# Altium schematic sheet RPi Motor Driver Rev 0.2.SchDoc
size C; GateName_1: G$1; SymbolName_1: FRAME_A3_ADAFRUIT; LibraryName: microbuilder; DeviceSetName: FRAME_A3_ADAFRUIT; Organization: Altium Limited; Address1: L3, 12a Rodborough Rd; Address2: Frenchs Forest; Address3: NSW; Address4: Australia 2086
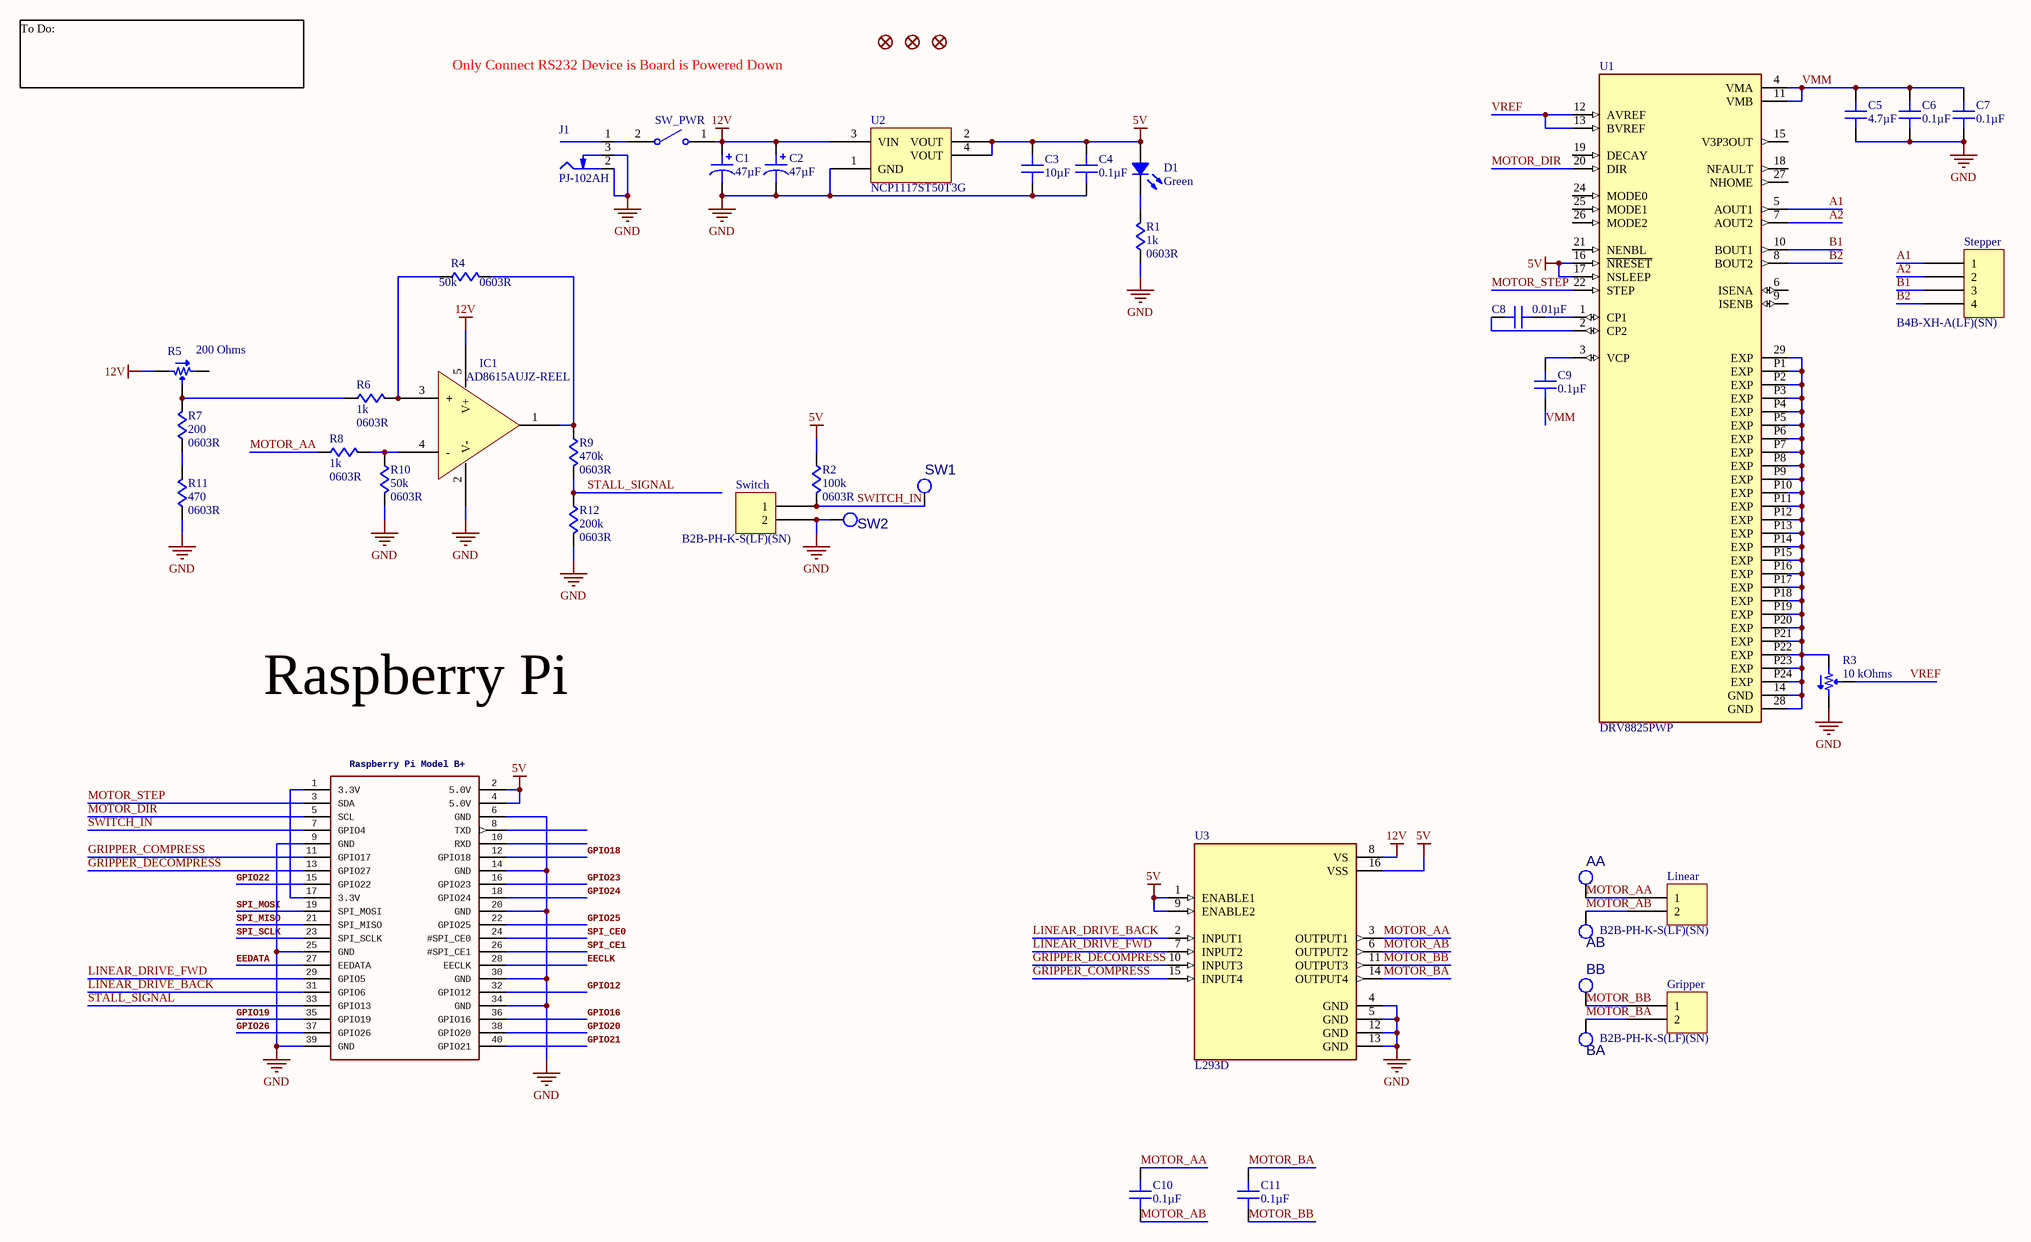
[diagram p0: RPi Motor Driver Rev 0.2.SchDoc]

## Parts
AA  TH_Testpoint_40mil  [TH_Testpoint_40mil]  (value not drawn)
AB  TH_Testpoint_40mil  [TH_Testpoint_40mil]  (value not drawn)
BA  TH_Testpoint_40mil  [TH_Testpoint_40mil]  (value not drawn)
BB  TH_Testpoint_40mil  [TH_Testpoint_40mil]  (value not drawn)
C1  47µF  [CAP ALSMD 6.6MM H6.1MM]
C2  47µF  [CAP ALSMD 6.6MM H6.1MM]
C3  10µF  [CAP 0805_2012]
C4  0.1µF  [CAP 0603_1608]
C5  4.7µF  [CAP 0603_1608]
C6  0.1µF  [CAP 0603_1608]
C7  0.1µF  [CAP 0603_1608]
C8  0.01µF  [CAP 0603_1608]
C9  0.1µF  [CAP 0603_1608]
C10  0.1µF  [CAP 0603_1608]
C11  0.1µF  [CAP 0603_1608]
D1  Green  [LED 0603_1608 GREEN]
FID1  FIDUCIAL""  [FIDUCIAL_1MM]  (value not drawn)
FID2  FIDUCIAL""  [FIDUCIAL_1MM]  (value not drawn)
FID3  FIDUCIAL""  [FIDUCIAL_1MM]  (value not drawn)
Gripper  B2B-PH-K-S(LF)(SN)  [JST B2B-PH-K]
IC1  AD8615AUJZ-REEL  [ANALOG TSOT-23-5 UJ-5]
J1  PJ-102AH  [CUI PJ-102AH]
Linear  B2B-PH-K-S(LF)(SN)  [JST B2B-PH-K]
R1  value 1k  [0603R]  (hidden comment: Resistor 0603)
R2  value 100k  [0603R]  (hidden comment: Resistor 0603)
R3  10 kOhms  [POT BOURNS TRIMPOT TC33]
R4  value 50k  [0603R]  (hidden comment: Resistor 0603)
R5  200 Ohms  [POT BOURNS TRIMPOT TC33]
R6  value 1k  [0603R]  (hidden comment: Resistor 0603)
R7  value 200  [0603R]  (hidden comment: Resistor 0603)
R8  value 1k  [0603R]  (hidden comment: Resistor 0603)
R9  value 470k  [0603R]  (hidden comment: Resistor 0603)
R10  value 50k  [0603R]  (hidden comment: Resistor 0603)
R11  value 470  [0603R]  (hidden comment: Resistor 0603)
R12  value 200k  [0603R]  (hidden comment: Resistor 0603)
RPI1  RaspberryPiModelB+: Raspberry Pi Model B+  [PI_HAT_SLOTS]  (hidden comment: RASPBERRYPI_BPLUS_HATSLOTS)
Stepper  B4B-XH-A(LF)(SN)  [JST XH B4B-XH-A]
SW1  TH_Testpoint_40mil  [TH_Testpoint_40mil]  (value not drawn)
SW2  TH_Testpoint_40mil  [TH_Testpoint_40mil]  (value not drawn)
SW_PWR  500SSP1S2M2QEA  [SWITCH SLIDE SPDT 5A 125V]  (value not drawn)
Switch  B2B-PH-K-S(LF)(SN)  [JST B2B-PH-K]
U1  DRV8825PWP  [SOP65P640X120-29N]
U2  NCP1117ST50T3G  [ON SEMI SOT-223 ST(318H)]
U3  L293D  [DIP880W50P254L2000H510Q16]

## Nets
5V: C3.2 C4.2 D1.1 R2.2 RPI1.2(5.0V) RPI1.4(5.0V) U1.16(~{NRESET}) U1.17(NSLEEP) U2.2(VOUT) U2.4(VOUT) U3.1(ENABLE1) U3.9(ENABLE2) U3.16(VSS)
12V: C1.1 C2.1 IC1.5(V+) R5.1 SW_PWR.1 U2.3(VIN) U3.8(VS)
GND: C1.2 C2.2 C3.1 C4.1 C5.1 C6.1 C7.1 IC1.2(V-) J1.2(Outer) J1.3(SW) R1.2 R3.3 R10.1 R11.2 R12.1 RPI1.6(GND) RPI1.9(GND) RPI1.14(GND) RPI1.20(GND) RPI1.25(GND) RPI1.30(GND) RPI1.34(GND) RPI1.39(GND) SW2.1 Switch.2 U2.1(GND) U3.4(GND) U3.5(GND) U3.12(GND) U3.13(GND)
A1: Stepper.1 U1.5(AOUT1)
A2: Stepper.2 U1.7(AOUT2)
B1: Stepper.3 U1.10(BOUT1)
B2: Stepper.4 U1.8(BOUT2)
EECLK: RPI1.28(EECLK)
EEDATA: RPI1.27(EEDATA)
GPIO12: RPI1.32(GPIO12)
GPIO16: RPI1.36(GPIO16)
GPIO18: RPI1.12(GPIO18)
GPIO19: RPI1.35(GPIO19)
GPIO20: RPI1.38(GPIO20)
GPIO21: RPI1.40(GPIO21)
GPIO22: RPI1.15(GPIO22)
GPIO23: RPI1.16(GPIO23)
GPIO24: RPI1.18(GPIO24)
GPIO25: RPI1.22(GPIO25)
GPIO26: RPI1.37(GPIO26)
GRIPPER_COMPRESS: RPI1.11(GPIO17) U3.15(INPUT4)
GRIPPER_DECOMPRESS: RPI1.13(GPIO27) U3.10(INPUT3)
LINEAR_DRIVE_BACK: RPI1.31(GPIO6) U3.2(INPUT1)
LINEAR_DRIVE_FWD: RPI1.29(GPIO5) U3.7(INPUT2)
MOTOR_AA: AA.1 C10.2 Linear.1 R8.2 U3.3(OUTPUT1)
MOTOR_AB: AB.1 C10.1 Linear.2 U3.6(OUTPUT2)
MOTOR_BA: BA.1 C11.2 Gripper.2 U3.14(OUTPUT4)
MOTOR_BB: BB.1 C11.1 Gripper.1 U3.11(OUTPUT3)
MOTOR_DIR: RPI1.5(SCL) U1.20(DIR)
MOTOR_STEP: RPI1.3(SDA) U1.22(STEP)
SPI_CE0: RPI1.24(#SPI_CE0)
SPI_CE1: RPI1.26(#SPI_CE1)
SPI_MISO: RPI1.21(SPI_MISO)
SPI_MOSI: RPI1.19(SPI_MOSI)
SPI_SCLK: RPI1.23(SPI_SCLK)
STALL_SIGNAL: R9.1 R12.2 RPI1.33(GPIO13)
SWITCH_IN: R2.1 RPI1.7(GPIO4) SW1.1 Switch.1
VMM: C5.2 C6.2 C7.2 C9.1 U1.4(VMA) U1.11(VMB)
VREF: R3.2 U1.12(AVREF) U1.13(BVREF)
NetC8_1: C8.1 U1.2(CP2)
NetC8_2: C8.2 U1.1(CP1)
NetC9_2: C9.2 U1.3(VCP)
NetD1_2: D1.2 R1.1
NetIC1_1: IC1.1(OUT) R4.1 R9.2
NetIC1_3: IC1.3(+) R4.2 R6.1
NetIC1_4: IC1.4(-) R8.1 R10.2
NetJ1_1: J1.1(Centre) SW_PWR.2
NetR3_1: R3.1 U1.14(GND) U1.28(GND) U1.29(EXP) U1.P1(EXP) U1.P2(EXP) U1.P3(EXP) U1.P4(EXP) U1.P5(EXP) U1.P6(EXP) U1.P7(EXP) U1.P8(EXP) U1.P9(EXP) U1.P10(EXP) U1.P11(EXP) U1.P12(EXP) U1.P13(EXP) U1.P14(EXP) U1.P15(EXP) U1.P16(EXP) U1.P17(EXP) U1.P18(EXP) U1.P19(EXP) U1.P20(EXP) U1.P21(EXP) U1.P22(EXP) U1.P23(EXP) U1.P24(EXP)
NetR5_2: R5.2 R6.2 R7.1
NetR7_2: R7.2 R11.1
NetRPI1_1: RPI1.1(3.3V) RPI1.17(3.3V)

Not connected (* = marked no-connect by the designer): R5 3; RPI1 8(TXD) 10(RXD); U1 6(ISENA) 9(ISENB) 15(V3P3OUT) 18(NFAULT) 19(DECAY) 21(NENBL) 24(MODE0) 25(MODE1) 26(MODE2) 27(NHOME)

## Notes on the sheet
- Only Connect RS232 Device is Board is Powered Down
- To Do:
- Raspberry Pi
- Title
- Size:
- Date:
- File:
- C
- Number:
- Time:
- Revision:
- Sheet
- of

## Library data of the parts
AA AB BA BB SW1 SW2 = TH_Testpoint_40mil: TH Testpoint
C1 C2 = UCD1V470MCL1GS: CAP ALUM 47UF 20% 35V SMD; Part Number: EEE-FP1V470AP; Manufacturer: Nichicon; Impedance: 360 mOhms; Lifetime @ Temp.: 2000 Hrs @ 105°C; Polarization: Polar; Ripple Current @ High Frequency: 240mA @ 100kHz; Ripple Current @ Low Frequency: 120mA @ 120Hz; Surface Mount Land Size: 0.260" L x 0.260" W (6.60mm x 6.60mm); Applications: Automotive; Capacitance: 47µF; ComponentLink1Description: Datasheet; ComponentLink1URL: http://nichicon-us.com/english/products/pdfs/e-ucd.pdf; ComponentLink2Description: DigiKey Link; ComponentLink2URL: http://digikey.com/product-detail/en/nichicon/UCD1V470MCL1GS/493-6426-1-ND/3438940; Device Package: Radial, Can - SMD; Height - Seated (Max): 0.240" (6.10mm); LastUpdated: 1/21/2020 4:04:57 AM; Lifecycle Status: Active; Minimum Order: 1; Mounting Type: Surface Mount; Operating Temperature: -55°C ~ 105°C; Package / Case: Radial, Can - SMD; Packaging: TapeAndReel; PartId: 8038; Part Status: Active; Price: 0.13; Ratings: AEC-Q200; Series: UCD; Size / Dimension: 0.248" Dia (6.30mm); Supplier 1: DigiKey; Supplier Part Number 1: 493-6426-1-ND; Tolerance: ±20%; Value: 47µF; Voltage - Rated: 35V
C3 = C2012X5R1E106K085AC: CAP CER 10UF 25V X5R 0805; Manufacturer: TDK Corporation; Tolerance: ±10%; Part Number: C2012X5R1E106K085AC; Value: 10µF; Applications: General Purpose; Capacitance: 10µF; ComponentLink1Description: Datasheet; ComponentLink1URL: https://product.tdk.com/info/en/catalog/datasheets/mlcc_commercial_general_en.pdf?ref_disty=digikey; ComponentLink2Description: DigiKey Link; ComponentLink2URL: http://digikey.com/product-detail/en/tdk-corporation/C2012X5R1E106K085AC/445-14387-1-ND/3956053; Device Package: 0805 (2012 Metric); Features: Low ESL; LastUpdated: 1/21/2020 12:02:45 AM; Lifecycle Status: Active; Minimum Order: 1; Mounting Type: Surface Mount, MLCC; Operating Temperature: -55°C ~ 85°C; Package / Case: 0805 (2012 Metric); Packaging: TapeAndReel; PartId: 15274; Part Status: Active; Price: 0.15; Series: C; Size / Dimension: 0.079" L x 0.049" W (2.00mm x 1.25mm); Supplier 1: DigiKey; Supplier Part Number 1: 445-14387-1-ND; Temperature Coefficient: X5R; Thickness (Max): 0.039" (1.00mm); Voltage - Rated: 25V
C4 C6 C7 C9-C11 = CGA3E2X7R1H104K080AE: CAP CER 0.1UF 50V X7R 0603; Manufacturer: TDK Corporation; Tolerance: ±10%; Part Number: CGA3E2X7R1H104K080AE; Value: 0.1µF; Applications: Automotive, Boardflex Sensitive; Capacitance: 0.1µF; ComponentLink1Description: Datasheet; ComponentLink1URL: https://product.tdk.com/info/en/catalog/datasheets/mlcc_automotive_soft_en.pdf?ref_disty=digikey; ComponentLink2Description: DigiKey Link; ComponentLink2URL: http://digikey.com/product-detail/en/tdk-corporation/CGA3E2X7R1H104K080AE/445-15957-1-ND/4490665; Device Package: 0603 (1608 Metric); Features: Soft Termination; LastUpdated: 1/21/2020 12:02:09 AM; Lifecycle Status: Active; Minimum Order: 1; Mounting Type: Surface Mount, MLCC; Operating Temperature: -55°C ~ 125°C; Package / Case: 0603 (1608 Metric); Packaging: TapeAndReel; PartId: 2715; Part Status: Active; Price: 0.02; Ratings: AEC-Q200; Series: CGA; Size / Dimension: 0.063" L x 0.031" W (1.60mm x 0.80mm); Supplier 1: DigiKey; Supplier Part Number 1: 445-15957-1-ND; Temperature Coefficient: X7R; Thickness (Max): 0.035" (0.90mm); Voltage - Rated: 50V
C5 = C1608X5R1V475M080AC: CAP CER 4.7UF 35V X5R 0603; Manufacturer: TDK Corporation; Tolerance: ±20%; Part Number: C1608X5R1V475M080AC; Value: 4.7µF; Applications: General Purpose; Capacitance: 4.7µF; ComponentLink1Description: Datasheet; ComponentLink1URL: https://product.tdk.com/info/en/catalog/datasheets/mlcc_commercial_general_en.pdf?ref_disty=digikey; ComponentLink2Description: DigiKey Link; ComponentLink2URL: http://digikey.com/product-detail/en/tdk-corporation/C1608X5R1V475M080AC/445-9042-1-ND/3648698; Device Package: 0603 (1608 Metric); Features: Low ESL; LastUpdated: 1/21/2020 12:02:09 AM; Lifecycle Status: Active; Minimum Order: 1; Mounting Type: Surface Mount, MLCC; Operating Temperature: -55°C ~ 85°C; Package / Case: 0603 (1608 Metric); Packaging: TapeAndReel; PartId: 2662; Part Status: Active; Price: 0.11; Series: C; Size / Dimension: 0.063" L x 0.031" W (1.60mm x 0.80mm); Supplier 1: DigiKey; Supplier Part Number 1: 445-9042-1-ND; Temperature Coefficient: X5R; Thickness (Max): 0.039" (1.00mm); Voltage - Rated: 35V
C8 = C0603C103KARACAUTO: CAP CER 0.01UF 250V X7R 0603; Manufacturer: KEMET; Tolerance: ±10%; Part Number: C0603C103KARACAUTO; Value: 0.01µF; Applications: Automotive, Bypass, Decoupling; Capacitance: 0.01µF; ComponentLink1Description: Datasheet; ComponentLink1URL: https://api.kemet.com/component-edge/download/datasheet/C0603C103KARACAUTO.pdf; ComponentLink2Description: DigiKey Link; ComponentLink2URL: http://digikey.com/product-detail/en/kemet/C0603C103KARACAUTO/399-17960-1-ND/9084030; Device Package: 0603 (1608 Metric); LastUpdated: 1/21/2020 12:01:45 AM; Lifecycle Status: Active; Minimum Order: 1; Mounting Type: Surface Mount, MLCC; Operating Temperature: -55°C ~ 125°C; Package / Case: 0603 (1608 Metric); Packaging: TapeAndReel; PartId: 15195; Part Status: Active; Price: 0.26; Ratings: AEC-Q200; Series: SMD Auto X7R; Size / Dimension: 0.063" L x 0.031" W (1.60mm x 0.80mm); Supplier 1: DigiKey; Supplier Part Number 1: 399-17960-1-ND; Temperature Coefficient: X7R; Thickness (Max): 0.034" (0.87mm); Voltage - Rated: 250V
D1 = APHD1608LCGCK: LED GREEN CLEAR 1608 SMD; Part Number: APT1608CGCK; Manufacturer: Kingbright; Configuration: Standard; Current - Test: 2mA; Lens Color: Colorless; Lens Size: 0.70mm Dia; Lens Style: Round with Domed Top; Millicandela Rating: 5mcd; Viewing Angle: 100°; Voltage - Forward (Vf) (Typ): 1.9V; Wavelength - Dominant: 570nm; Wavelength - Peak: 574nm; Color: Green; ComponentLink1Description: Datasheet; ComponentLink1URL: http://www.kingbrightusa.com/images/catalog/SPEC/APHD1608LCGCK.pdf; ComponentLink2Description: DigiKey Link; ComponentLink2URL: http://digikey.com/product-detail/en/kingbright/APHD1608LCGCK/754-2031-1-ND/7043085; Device Package: 0603 (1608 Metric); Height (Max): 0.75mm; LastUpdated: 1/21/2020 3:12:15 AM; Lens Transparency: Clear; Lifecycle Status: Active; Minimum Order: 1; Mounting Type: Surface Mount; Package / Case: 0603 (1608 Metric); Packaging: TapeAndReel; PartId: 602; Part Status: Active; Price: 0.10; Series: -; Size / Dimension: 1.60mm L x 0.80mm W; Supplier 1: DigiKey; Supplier Part Number 1: 754-2031-1-ND; Supplier Device Package: 1608; Value: Green
FID1-FID3 = FIDUCIAL"": Fiducial Alignment PointsVarious fiducial points for machine vision alignment.; GateName_1: G$1; DeviceName: ""; BOM: EXCLUDE; SymbolName_1: FIDUCIAL; LibraryName: microbuilder; DeviceSetName: FIDUCIAL
Gripper Linear Switch = B2B-PH-K-S(LF)(SN): CONN HEADER VERT 2POS 2MM; Manufacturer: JST Sales America Inc.; Contact Length - Mating: 0.130" (3.30mm); Contact Length - Post: 0.134" (3.40mm); Current Rating (Amps): 2A; Material Flammability Rating: UL94 V-0; Number of Positions: 2; Number of Positions Loaded: All; Overall Contact Length: 0.333" (8.45mm); Pitch - Mating: 0.079" (2.00mm); Shrouding: Shrouded - 4 Wall; Style: Board to Cable/Wire; Voltage Rating: 100V; Part Number: B2B-PH-K-S(LF)(SN); ComponentLink1Description: Datasheet; ComponentLink1URL: http://www.jst-mfg.com/product/pdf/eng/ePH.pdf; ComponentLink2Description: DigiKey Link; ComponentLink2URL: http://digikey.com/product-detail/en/jst-sales-america-inc/B2B-PH-K-S-LF-SN/455-1704-ND/926611; Connector Type: Header; Contact Finish - Mating: Tin; Contact Finish - Post: Tin; Contact Material: Brass; Contact Shape: Square; Contact Type: Male Pin; Fastening Type: Detent Lock; Insulation Color: Natural; Insulation Height: 0.236" (6.00mm); Insulation Material: Polyamide (PA66), Nylon 6/6; LastUpdated: 1/3/2020 11:40:58 PM; Lifecycle Status: Active; Minimum Order: 1; Mounting Type: Through Hole; Number of Rows: 1; Operating Temperature: -25°C ~ 85°C; Packaging: Bulk; PartId: 11; Part Status: Active; Price: 0.17; Series: PH; Supplier 1: DigiKey; Supplier Part Number 1: 455-1704-ND; Termination: Press-Fit, Solder
IC1 = AD8615AUJZ-REEL: IC OPAMP GP 1 CIRCUIT TSOT23-5; Manufacturer: Analog Devices Inc.; Amplifier Type: General Purpose; Current - Input Bias: 0.2pA; Current - Output / Channel: 150mA; Current - Supply: 1.7mA; Gain Bandwidth Product: 24MHz; Number of Circuits: 1; Output Type: Rail-to-Rail; Slew Rate: 12V/µs; Voltage - Input Offset: 23µV; Voltage - Supply, Single/Dual (±): 2.7V ~ 5.5V, ±1.35V ~ 2.75V; Part Number: AD8615AUJZ-REEL; ComponentLink1Description: Datasheet; ComponentLink1URL: https://www.analog.com/media/en/technical-documentation/data-sheets/AD8615_8616_8618.pdf; ComponentLink2Description: DigiKey Link; ComponentLink2URL: //digikey.com/product-detail/en/analog-devices-inc/AD8615AUJZ-REEL/AD8615AUJZ-REELTR-ND/993826; Device Package: SOT-23-5 Thin, TSOT-23-5; LastUpdated: 12/9/2019 2:06:44 AM; Lifecycle Status: 0; Minimum Order: 1; Mounting Type: Surface Mount; Operating Temperature: -40°C ~ 125°C; Package / Case: SOT-23-5 Thin, TSOT-23-5; Packaging: TapeAndReel; PartId: 5; Part Status: Active; Price: 1.06; Series: DigiTrim®; Supplier 1: DigiKey; Supplier Part Number 1: AD8615AUJZ-REELTR-ND; Supplier Device Package: TSOT-23-5
J1 = PJ-102AH: CONN PWR JACK 2X5.5MM SOLDER; Manufacturer: CUI Devices; Actual Diameter: 0.079" (2.00mm ID), 0.256" (6.50mm OD); Current Rating (Amps): 5A; Gender: Male; Industry Recognized Mating Diameter: 2.00mm ID (0.079"), 5.50mm OD (0.217"); Internal Switch(s): Single Switch, Normally Closed; Material Flammability Rating: UL94 V-0; Mating Length/Depth: 0.354" (9.00mm); Number of Positions/Contacts: 2 Conductors, 3 Contacts; Shielding: Unshielded; Voltage - Rated: 24VDC; Part Number: PJ-102AH; ComponentLink1Description: Datasheet; ComponentLink1URL: https://www.cuidevices.com/product/resource/digikeypdf/pj-102ah.pdf; ComponentLink2Description: DigiKey Link; ComponentLink2URL: //digikey.com/product-detail/en/cui-devices/PJ-102AH/CP-102AH-ND/408448; Connector Type: Jack; LastUpdated: 12/16/2019 7:01:27 PM; Lifecycle Status: 0; Minimum Order: 1; Mounting Type: Through Hole, Right Angle; Packaging: Tray; Part Status: Active; Price: 0.76; Series: -; Supplier 1: DigiKey; Supplier Part Number 1: CP-102AH-ND; Termination: Solder
R1 R6 R8 = Resistor: Manufacturer Part Number 1: CRCW06031K00FKTA; Manufacturer 1: Vishay Dale; Size: 0603R
R2 = Resistor: Manufacturer 1: Vishay Dale; Manufacturer Part Number 1: CRCW0603100KFKTA; Size: 0603R
R3 = TC33X-2-103E: TRIMMER 10K OHM 0.1W J LEAD TOP; Manufacturer: Bourns Inc.; Adjustment Type: Top Adjustment; Number of Turns: 1; Power (Watts): 0.1W, 1/10W; Resistive Material: Cermet; Temperature Coefficient: ±250ppm/°C; Tolerance: ±25%; Part Number: TC33X-2-103E; ComponentLink1Description: Datasheet; ComponentLink1URL: https://www.bourns.com/docs/Product-Datasheets/TC33.pdf; ComponentLink2Description: DigiKey Link; ComponentLink2URL: http://digikey.com/product-detail/en/bourns-inc/TC33X-2-103E/TC33X-103ECT-ND/612911; LastUpdated: 1/21/2020 3:20:18 AM; Lifecycle Status: Active; Minimum Order: 1; Mounting Type: Surface Mount; Packaging: TapeAndReel; PartId: 8; Part Status: Active; Price: 0.15; Resistance: 10 kOhms; Series: Trimpot® TC33 - Open Frame; Size / Dimension: Rectangular - 0.150" x 0.142" Face x 0.047" H (3.80mm x 3.60mm x 1.20mm); Supplier 1: DigiKey; Supplier Part Number 1: TC33X-103ECT-ND; Termination Style: J Lead; Value: 10 kOhms
R4 R10 = Resistor: Manufacturer Part Number 1: RC0603FR-0749K9L; Manufacturer 1: Yageo; Size: 0603R
R5 = TC33X-2-201E: TRIMMER 200 OHM 0.1W J LEAD TOP; Manufacturer: Bourns Inc.; Adjustment Type: Top Adjustment; Number of Turns: 1; Power (Watts): 0.1W, 1/10W; Resistive Material: Cermet; Temperature Coefficient: ±250ppm/°C; Tolerance: ±25%; Part Number: TC33X-2-201E; ComponentLink1Description: Datasheet; ComponentLink1URL: https://www.bourns.com/docs/Product-Datasheets/TC33.pdf; ComponentLink2Description: DigiKey Link; ComponentLink2URL: http://digikey.com/product-detail/en/bourns-inc/TC33X-2-201E/TC33X-2-201ECT-ND/3437928; LastUpdated: 8/13/2020 10:53:13 AM; Lifecycle Status: Active; Minimum Order: 1; Mounting Type: Surface Mount; Packaging: TapeAndReel; PartId: 3; Part Status: Active; Price: 0.15; Resistance: 200 Ohms; Series: Trimpot® TC33 - Open Frame; Size / Dimension: Rectangular - 0.150" x 0.142" Face x 0.047" H (3.80mm x 3.60mm x 1.20mm); Supplier 1: DigiKey; Supplier Part Number 1: TC33X-2-201ECT-ND; Termination Style: J Lead; Value: 200 Ohms
R7 = Resistor: Manufacturer Part Number 1: CRCW0603200RFKTA; Manufacturer 1: Vishay Dale; Size: 0603R
R9 = Resistor: Manufacturer Part Number 1: ERJ-3EKF4703V; Manufacturer 1: Panasonic Electronic Components; Size: 0603R
R11 = Resistor: Manufacturer Part Number 1: AF0603FR-07470RL; Manufacturer 1: Yageo; Size: 0603R
R12 = Resistor: Manufacturer Part Number 1: CRCW0603200KFKTA; Manufacturer 1: Vishay Dale; Size: 0603R
RPI1 = RASPBERRYPI_BPLUS_HATSLOTS: GateName_1: G$1; SymbolName_1: RASPBERRYPI_BPLUS; DeviceName: _HATSLOTS; LibraryName: microbuilder; DeviceSetName: RASPBERRYPI_BPLUS
Stepper = B4B-XH-A(LF)(SN): CONN HEADER VERT 4POS 2.5MM; Manufacturer: JST Sales America Inc.; Contact Length - Post: 0.134" (3.40mm); Current Rating (Amps): 3A; Material Flammability Rating: UL94 V-0; Number of Positions: 4; Number of Positions Loaded: All; Pitch - Mating: 0.098" (2.50mm); Shrouding: Shrouded - 4 Wall; Style: Board to Cable/Wire; Voltage Rating: 250V; Part Number: B4B-XH-A(LF)(SN); ComponentLink1Description: Datasheet; ComponentLink1URL: http://www.jst-mfg.com/product/pdf/eng/eXH.pdf; ComponentLink2Description: DigiKey Link; ComponentLink2URL: http://digikey.com/product-detail/en/jst-sales-america-inc/B4B-XH-A-LF-SN/455-2249-ND/1651047; Connector Type: Header; Contact Finish - Mating: Tin; Contact Finish - Post: Tin; Contact Material: Brass; Contact Shape: Square; Contact Type: Male Pin; Fastening Type: Detent Lock; Insulation Color: Natural; Insulation Height: 0.276" (7.00mm); Insulation Material: Polyamide (PA66), Nylon 6/6; LastUpdated: 1/12/2020 11:46:34 PM; Lifecycle Status: Active; Minimum Order: 1; Mounting Type: Through Hole; Number of Rows: 1; Operating Temperature: -25°C ~ 85°C; Packaging: Bulk; PartId: 69; Part Status: Active; Price: 0.21; Series: XH; Supplier 1: DigiKey; Supplier Part Number 1: 455-2249-ND; Termination: Press-Fit, Solder
SW_PWR = SWITCH SLIDE SPDT 5A 125V: Manufacturer 1: E-Switch Inc.; MFG PN: 500SSP1S2M2QEA; Manufacturer Part Number 1: 500SSP1S2M2QEA
U1 = DRV8825PWP: Bipolar Motor Driver Power MOSFET Logic 28-HTSSOP; Manufacturer 1: Texas Instruments; Package: HTSSOP-28 Texas Instruments; Price: None; SnapEDA_Link: https://www.snapeda.com/parts/DRV8825PWP/Texas%20Instruments/view-part/52585/?ref=snap; Availability: Unavailable; Value: *; MP: DRV8825PWP; Manufacturer Part Number 1: DRV8825PWP
U2 = NCP1117ST50T3G: IC REG LINEAR 5V 1A SOT223; Manufacturer: ON Semiconductor; Current - Quiescent (Iq): 10mA; Number of Regulators: 1; Output Configuration: Positive; Output Type: Fixed; Protection Features: Over Current, Over Temperature; PSRR: 61dB (120Hz); Voltage Dropout (Max): 1.2V @ 800mA; Voltage - Input (Max): 20V; Part Number: NCP1117ST50T3G; ComponentLink1Description: Datasheet; ComponentLink1URL: https://www.onsemi.com/pub/Collateral/NCP1117-D.PDF; ComponentLink2Description: DigiKey Link; ComponentLink2URL: http://digikey.com/product-detail/en/on-semiconductor/NCP1117ST50T3G/NCP1117ST50T3GOSCT-ND/1967217; Current - Output: 1A; Device Package: TO-261-4, TO-261AA; LastUpdated: 1/21/2020 3:56:44 AM; Lifecycle Status: Active; Minimum Order: 1; Mounting Type: Surface Mount; Operating Temperature: 0°C ~ 125°C; Package / Case: TO-261-4, TO-261AA; Packaging: TapeAndReel; Part Status: Active; Price: 0.16; Series: -; Supplier 1: DigiKey; Supplier Part Number 1: NCP1117ST50T3GOSCT-ND; Supplier Device Package: SOT-223; Voltage - Output (Min/Fixed): 5V
U3 = L293D: Bipolar Motor Driver Parallel 16-PowerDIP; Manufacturer 1: STMicroelectronics; Availability: Unavailable; SnapEDA_Link: https://www.snapeda.com/parts/L293D/STMicroelectronics/view-part/83726/?ref=snap; Mfg PN: L293D; Price: None; Package: SOIC-20 STMicroelectronics; Value: *; Manufacturer Part Number 1: L293D